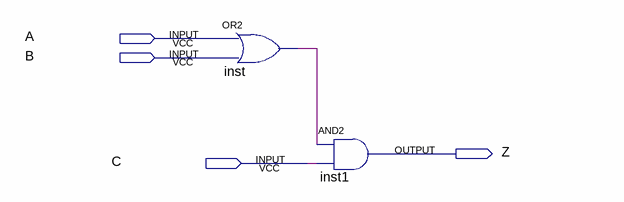
[diagram p0: schematic sheet]
// Quartus schematic Lab13.bdf as structural Verilog: 2 symbols, 4 pins
module Lab13 (
  input  A,
  input  B,
  input  C,
  output Z
);

  wire inst_out;

  or inst (inst_out, A, B);
  and inst1 (Z, inst_out, C);
endmodule
